# Altium schematic sheet Wifi-MX8M.SchDoc
size B; SheetNumber: 10; SheetTotal: 16
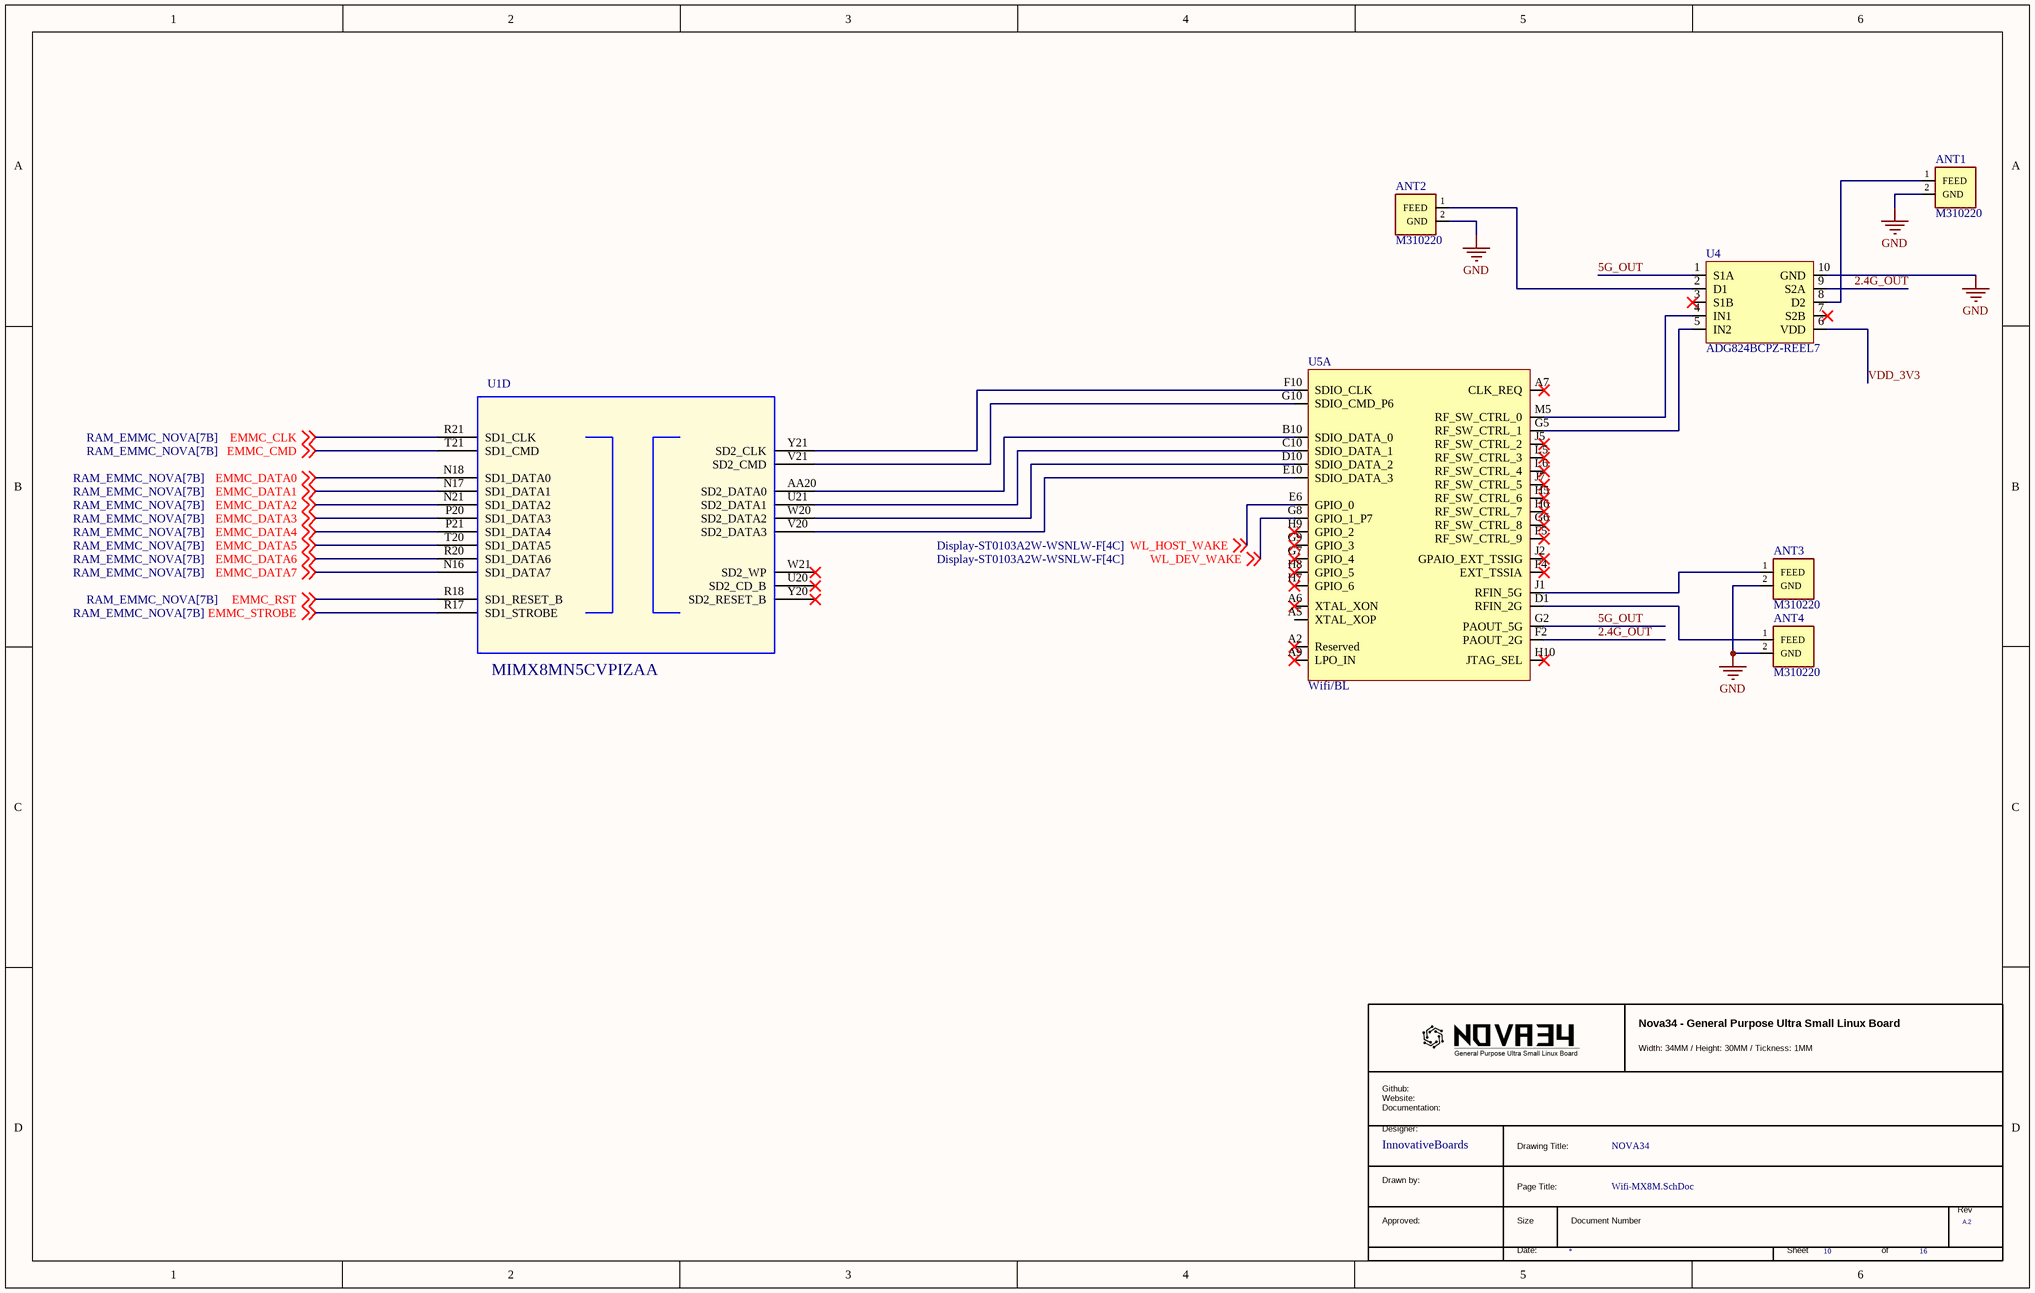
[diagram p0: Wifi-MX8M.SchDoc]

## Parts
*  RevCode: A.2  (hidden comment: TitleBlock_MCPG)  (graphical)
ANT1  M310220  [M310220]
ANT2  M310220  [M310220]
ANT3  M310220  [M310220]
ANT4  M310220  [M310220]
U1  MIMX8MN5CVPIZAA  [BGA306C50P21X21_1100X1100X101]  (part D of 12)
U4  ADG824BCPZ-REEL7  [ADG824]
U5  Wifi/BL  [106 BALL WLBGA 3.76X4.43X0.53 MM]  (part A of 3)

## Nets
GND: ANT1.2(GND) ANT2.2(GND) ANT3.2(GND) ANT4.2(GND) U4.10(GND)
2.4G_OUT: U4.9(S2A) U5.F2(PAOUT_2G)
5G_OUT: U4.1(S1A) U5.G2(PAOUT_5G)
EMMC_CLK: U1.R21(SD1_CLK) ; off-sheet EMMC_CLK
EMMC_CMD: U1.T21(SD1_CMD) ; off-sheet EMMC_CMD
EMMC_DATA0: U1.N18(SD1_DATA0) ; off-sheet EMMC_DATA0
EMMC_DATA1: U1.N17(SD1_DATA1) ; off-sheet EMMC_DATA1
EMMC_DATA2: U1.N21(SD1_DATA2) ; off-sheet EMMC_DATA2
EMMC_DATA3: U1.P20(SD1_DATA3) ; off-sheet EMMC_DATA3
EMMC_DATA4: U1.P21(SD1_DATA4) ; off-sheet EMMC_DATA4
EMMC_DATA5: U1.T20(SD1_DATA5) ; off-sheet EMMC_DATA5
EMMC_DATA6: U1.R20(SD1_DATA6) ; off-sheet EMMC_DATA6
EMMC_DATA7: U1.N16(SD1_DATA7) ; off-sheet EMMC_DATA7
EMMC_RST: U1.R18(SD1_RESET_B) ; off-sheet EMMC_RST
EMMC_STROBE: U1.R17(SD1_STROBE) ; off-sheet EMMC_STROBE
VDD_3V3: U4.6(VDD)
WL_DEV_WAKE: U5.G8(GPIO_1_P7) ; off-sheet WL_DEV_WAKE
WL_HOST_WAKE: U5.E6(GPIO_0) ; off-sheet WL_HOST_WAKE
NetANT1_1: ANT1.1(FEED) U4.8(D2)
NetANT2_1: ANT2.1(FEED) U4.2(D1)
NetANT3_1: ANT3.1(FEED) U5.J1(RFIN_5G)
NetANT4_1: ANT4.1(FEED) U5.D1(RFIN_2G)
NetU1_AA20: U1.AA20(SD2_DATA0) U5.B10(SDIO_DATA_0)
NetU1_U21: U1.U21(SD2_DATA1) U5.C10(SDIO_DATA_1)
NetU1_V20: U1.V20(SD2_DATA3) U5.E10(SDIO_DATA_3)
NetU1_V21: U1.V21(SD2_CMD) U5.G10(SDIO_CMD_P6)
NetU1_W20: U1.W20(SD2_DATA2) U5.D10(SDIO_DATA_2)
NetU1_Y21: U1.Y21(SD2_CLK) U5.F10(SDIO_CLK)
NetU4_4: U4.4(IN1) U5.M5(RF_SW_CTRL_0)
NetU4_5: U4.5(IN2) U5.G5(RF_SW_CTRL_1)

Not connected (* = marked no-connect by the designer): U1 U20(SD2_CD_B)* W21(SD2_WP)* Y20(SD2_RESET_B)*; U4 3(S1B)* 7(S2B)*; U5 A2(Reserved)* A5(XTAL_XOP) A6(XTAL_XON)* A7(CLK_REQ)* A9(LPO_IN)* F4(EXT_TSSIA)* F5(RF_SW_CTRL_9)* G6(RF_SW_CTRL_8)* G7(GPIO_4)* G9(GPIO_3)* H5(RF_SW_CTRL_6)* H6(RF_SW_CTRL_7)* H7(GPIO_6)* H8(GPIO_5)* H9(GPIO_2)* H10(JTAG_SEL)* J2(GPAIO_EXT_TSSIG)* J5(RF_SW_CTRL_2)* J7(RF_SW_CTRL_5)* L5(RF_SW_CTRL_3)* L6(RF_SW_CTRL_4)*

## Notes on the sheet
- (in symbol TitleBlock_MCPG) Nova34 - General Purpose Ultra Small Linux Board; Width: 34MM / Height: 30MM / Tickness: 1MM; Github: / Website: / Documentation:; Designer:; InnovativeBoards; Drawing Title:; NOVA34; Drawn by:; Page Title:; Rev; Approved:; Size; Document Number; Date:; Sheet; of

## Library data of the parts
ANT1-ANT4 = M310220: Antennas WiFi/BT Ceramic; Manufacturer_Name: Kyocera AVX; Datasheet Link: https://mouser.componentsearchengine.com/Datasheets/1/M310220.pdf; Height: 1.18mm; Manufacturer_Part_Number: M310220; Mouser Part Number: 581-M310220; Mouser Price/Stock: https://www.mouser.co.uk/ProductDetail/KYOCERA-AVX/M310220?qs=MLItCLRbWsySMY3y23wkRg%3D%3D; Arrow Part Number: M310220; Arrow Price/Stock: https://www.arrow.com/en/products/m310220/avx?utm_currency=USD&region=nac
U1 = MIMX8MN: IC CPU QUAD CORTEX A53+M7 1.4GHZ -- BGA306; PCB Footprint: pbga306_0p5_sq11mm; AGILE_PN: TMP-CIP-5098; CAD_APPROVED: Yes; PRE_APN: 330-77152; Temp Range: -40¡ãC to 105¡ãC; MFG_NAME01: NXP SEMICONDUCTORS; CLASS: IC; HEIGHT: 1.01MM; ROHS: Yes; MFG_PN01: MIMX8MN5CVPIZAA
U4 = ADG824BCPZ-REEL7: IC SWITCH SPDTX2 800MOHM 10LFCSP; ComponentLink1Description: New link; ComponentLink1URL: https://www.digikey.com/en/products/detail/analog-devices-inc/ADG824BCPZ-REEL7/1956054
U5 = CYW43012
* = TitleBlock_MCPG: Page Create Date: March  8, 1995